# EAGLE design powermeter (EAGLE 7.2.0)
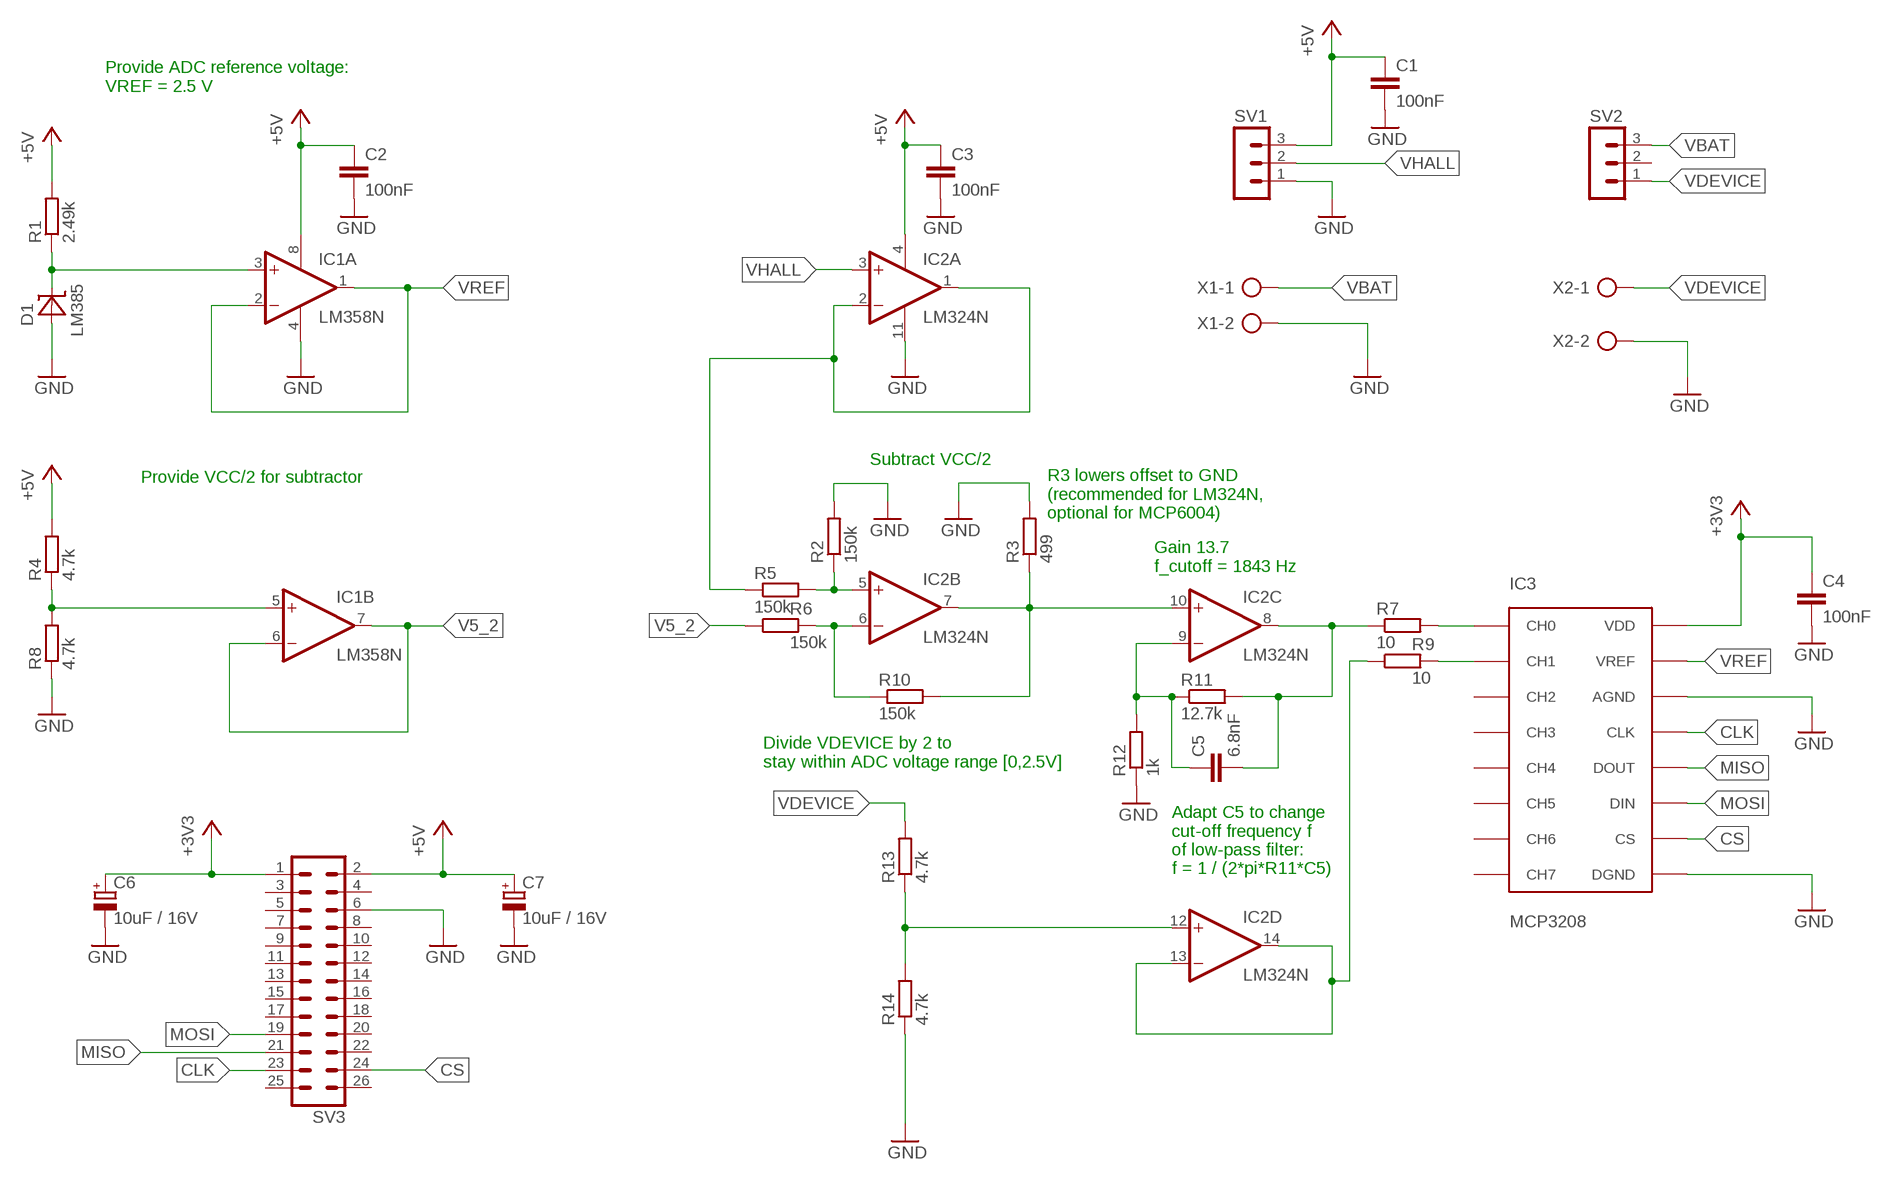
[diagram p0: schematic, sheet 1]

## Parts
C1  100nF  C-EU050-024X044  [C050-024X044]
C2  100nF  C-EU050-024X044  [C050-024X044]
C3  100nF  C-EU050-024X044  [C050-024X044]
C4  100nF  C-EU050-024X044  [C050-024X044]
C5  6.8nF  C-EU050-030X075  [C050-030X075]
C6  10uF / 16V  CPOL-EUE2.5-5  [E2,5-5]
C7  10uF / 16V  CPOL-EUE2.5-5  [E2,5-5]
D1  LM385  [TO-92]
IC1  LM358N  [DIL08]
IC2  LM324N  [DIL14]
IC3  MCP3208  [DIL16]
R1  2.49k  R-EU_0207/7  [0207/7]
R2  150k  R-EU_0207/7  [0207/7]
R3  499  R-EU_0207/7  [0207/7]
R4  4.7k  R-EU_0207/7  [0207/7]
R5  150k  R-EU_0207/7  [0207/7]
R6  150k  R-EU_0207/7  [0207/7]
R7  10  R-EU_0207/7  [0207/7]
R8  4.7k  R-EU_0207/7  [0207/7]
R9  10  R-EU_0207/7  [0207/7]
R10  150k  R-EU_0207/7  [0207/7]
R11  12.7k  R-EU_0207/7  [0207/7]
R12  1k  R-EU_0207/7  [0207/7]
R13  4.7k  R-EU_0207/7  [0207/7]
R14  4.7k  R-EU_0207/7  [0207/7]
SV1  MA03-1  [MA03-1]
SV2  MA03-1  [MA03-1]
SV3  ML26  [ML26]
X1  AK500/2  [AK500/2]
X2  AK500/2  [AK500/2]

## Nets
+3V3: C4.1 C6.+ IC3.VDD SV3.1
+5V: C1.1 C2.1 C3.1 C7.+ IC1.8(P:V+) IC2.4(P:V+) R1.2 R4.2 SV1.3 SV3.2
CLK: IC3.CLK SV3.23
CS: IC3.CS SV3.24
GND: C1.2 C2.2 C3.2 C4.2 C6.- C7.- D1.+ IC1.4(P:V-) IC2.11(P:V-) IC3.AGND IC3.DGND R2.2 R3.2 R8.1 R12.1 R14.1 SV1.1 SV3.6 X1.2 X2.2
MISO: IC3.DOUT SV3.21
MOSI: IC3.DIN SV3.19
N$1: IC1.5(B:+IN) R4.1 R8.2
N$2: C5.2 IC2.8(C:OUT) R7.1 R11.2
N$3: D1.- IC1.3(A:+IN) R1.1
N$4: IC2.1(A:OUT) IC2.2(A:-IN) R5.1
N$5: IC2.5(B:+IN) R2.1 R5.2
N$6: IC2.7(B:OUT) IC2.10(C:+IN) R3.1 R10.2
N$7: IC2.6(B:-IN) R6.2 R10.1
N$8: C5.1 IC2.9(C:-IN) R11.1 R12.2
N$10: IC3.CH0 R7.2
N$11: IC2.12(D:+IN) R13.1 R14.2
N$12: IC2.13(D:-IN) IC2.14(D:OUT) R9.1
N$13: IC3.CH1 R9.2
V5_2: IC1.6(B:-IN) IC1.7(B:OUT) R6.1
VBAT: SV2.3 X1.1
VDEVICE: R13.2 SV2.1 X2.1
VHALL: IC2.3(A:+IN) SV1.2
VREF: IC1.1(A:OUT) IC1.2(A:-IN) IC3.VREF
Unconnected: IC3.CH2 IC3.CH3 IC3.CH4 IC3.CH5 IC3.CH6 IC3.CH7 SV2.2 SV3.3 SV3.4 SV3.5 SV3.7 SV3.8 SV3.9 SV3.10 SV3.11 SV3.12 SV3.13 SV3.14 SV3.15 SV3.16 SV3.17 SV3.18 SV3.20 SV3.22 SV3.25 SV3.26

## Notes on the sheet
- Provide ADC reference voltage:
  VREF = 2.5 V
- Subtract VCC/2
- Provide VCC/2 for subtractor
- R3 lowers offset to GND
  (recommended for LM324N,
  optional for MCP6004)
- Gain 13.7
  f_cutoff = 1843 Hz
- Divide VDEVICE by 2 to
  stay within ADC voltage range [0,2.5V]
- Adapt C5 to change 
  cut-off frequency f
  of low-pass filter:
  f = 1 / (2*pi*R11*C5)

## Library data of the parts
C1-C5 = rcl:C-EU: CAPACITOR, European symbol
C6 C7 = rcl:CPOL-EU: POLARIZED CAPACITOR, European symbol
D1 = lm385:LM385: LM385 LM385 Micropower Voltage Reference
IC1 = linear:LM358: OP AMP also LM158; LM258; LM2904 Source: http://cache.national.com/ds/LM/LM158.pdf
IC2 = linear:LM324: OP AMP
IC3 = mcp3208:MCP3208
R1-R14 = rcl:R-EU_: RESISTOR, European symbol
SV1 SV2 = con-lstb:MA03-1: PIN HEADER; OC_FARNELL: unknown; OC_NEWARK: unknown
SV3 = con-harting-ml:ML26: HARTING; OC_FARNELL: unknown; OC_NEWARK: unknown
X1 X2 = con-ptr500:AK500/2: CONNECTOR; OC_FARNELL: unknown; OC_NEWARK: unknown

## Board
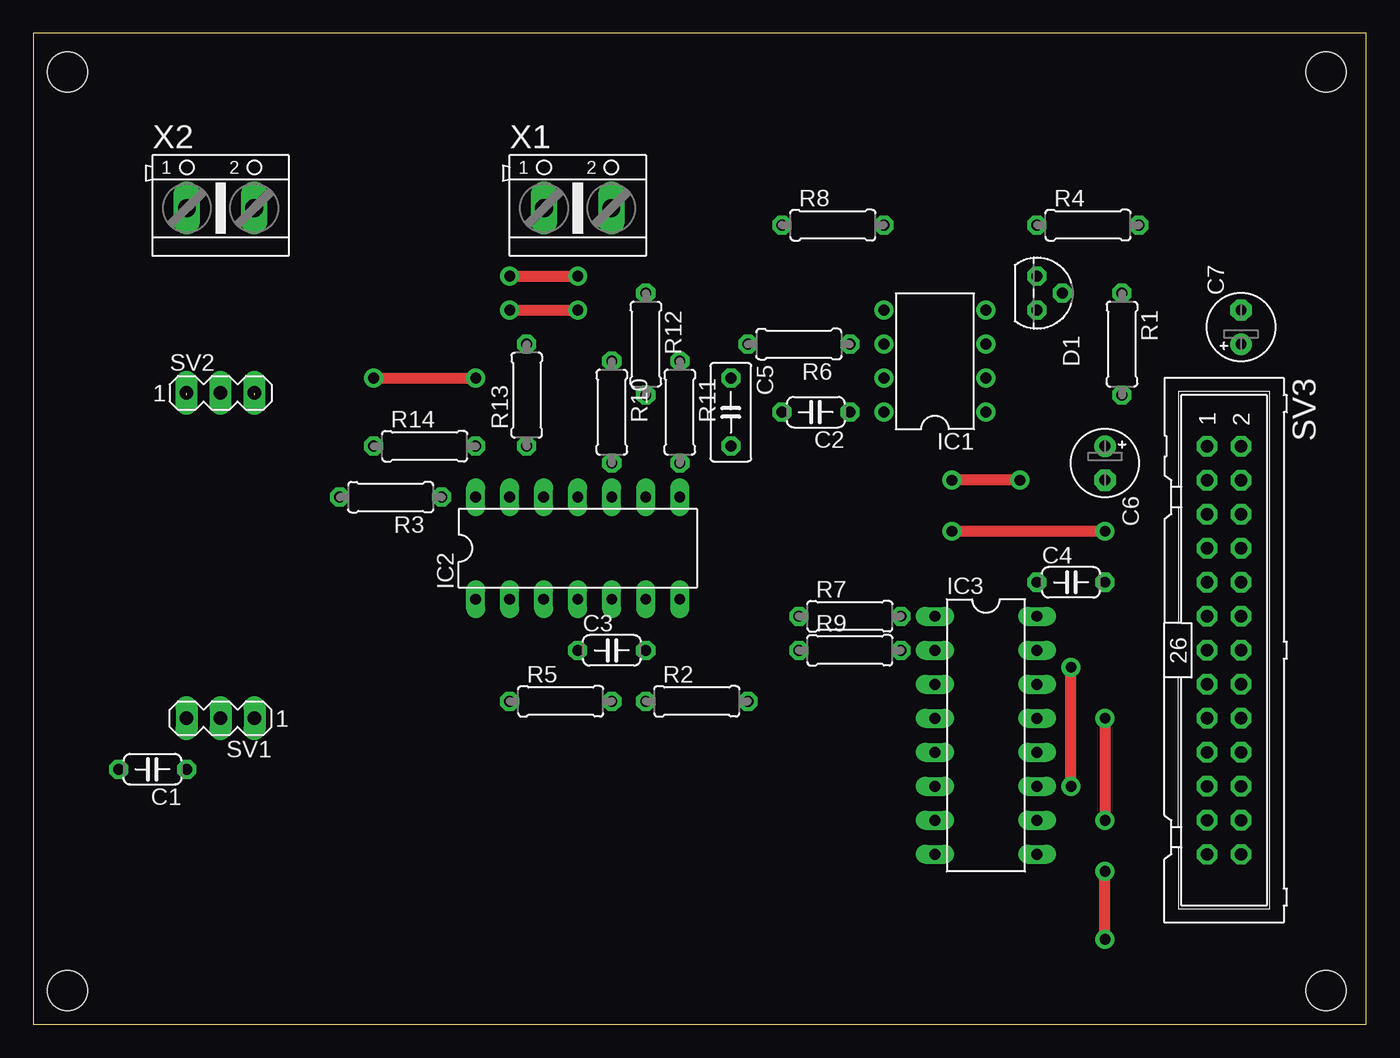
[diagram p1: board, top side]
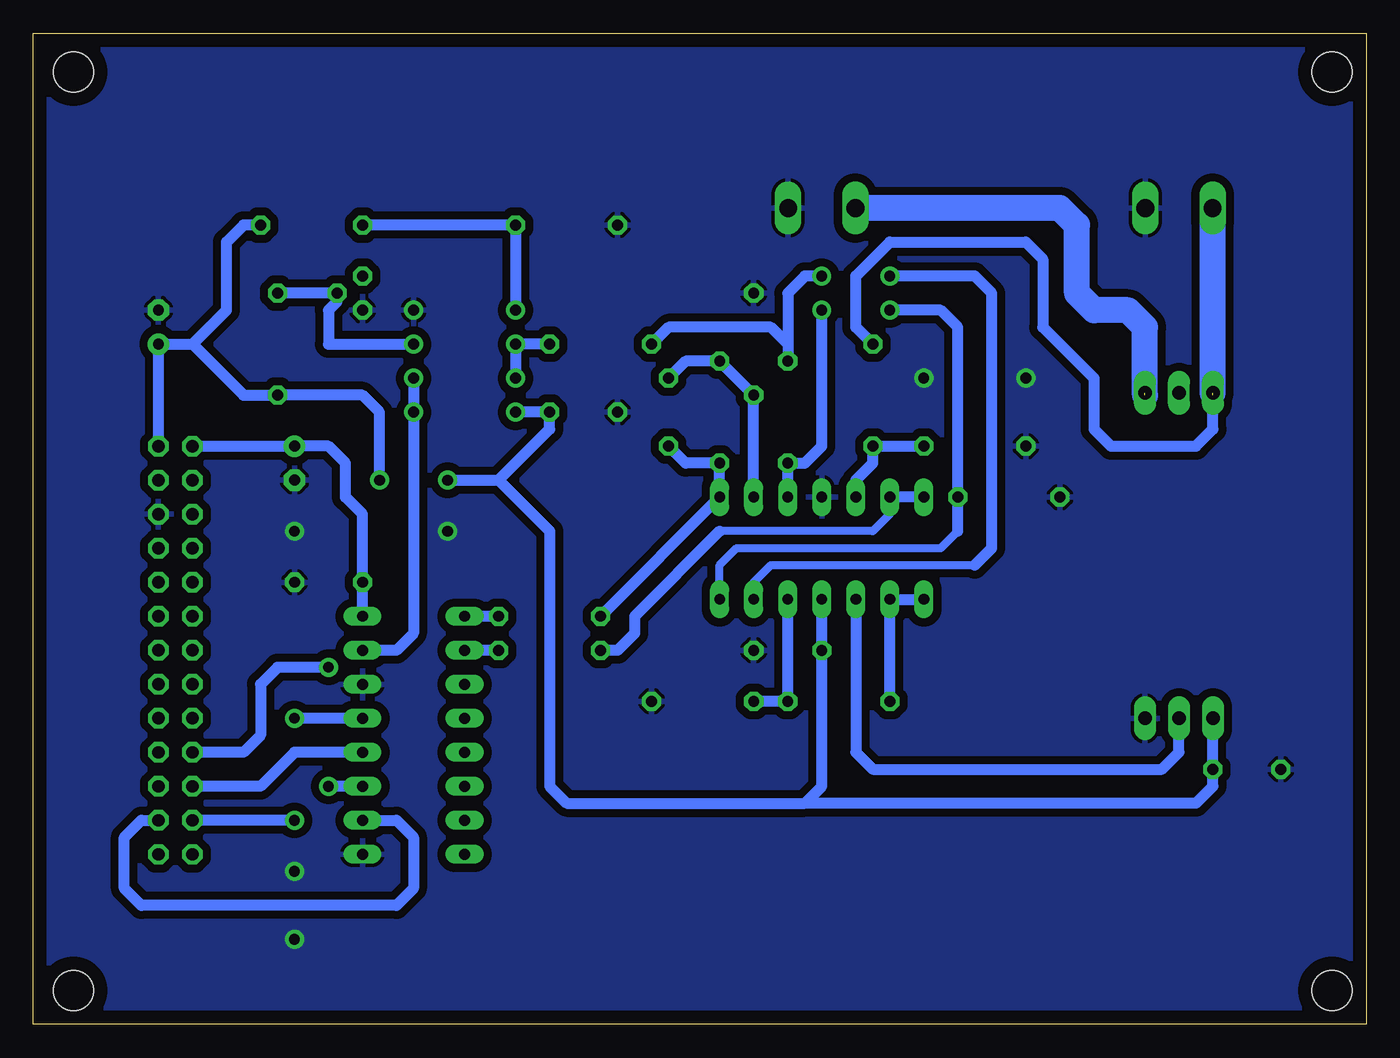
[diagram p2: board, bottom side, seen from below]

Size 99.5 x 74 mm. Coordinates in mm from the lower left corner, seen from the top.
Outline: 0,0 99.5,0 99.5,74 0,74 0,0
Copper layers (1*16): Top 0.035mm / dielectric 1.5mm / Bottom 0.035mm
Design rules "default *": minimum track width 10mil, minimum drill 24mil, track to track 24mil, track to pad 24mil, pad to pad 24mil, via to via 24mil, smd to smd 8mil, copper to edge 40mil, drill to drill 8mil, minimum pad ring 12mil, minimum via ring 12mil, stop-mask expansion 4mil, vias tented up to drill 0mil, thermal gap 10mil
Holes 3 mm at 2.54,71.12 96.52,71.12 2.54,2.54 96.52,2.54

### Footprints (pad centres in the part's own frame; a part is rotated, then mirrored left to right if it is on the bottom)
C050-024X044 = drill 0.813 octagon: 1 -2.54,0; 2 2.54,0
C050-030X075 = drill 0.813 octagon: 1 -2.54,0; 2 2.54,0
E2,5-5 = drill 0.813 pad 1.6: + -1.27,0 | drill 0.813 pad 1.6 octagon: - 1.27,0
TO-92 = drill 0.813 octagon: + 1.27,0; - 0,1.905; NC -1.27,0
DIL08 = drill 0.813 pad 1.27: 1 -3.81,-3.81; 2 -1.27,-3.81; 3 1.27,-3.81; 4 3.81,-3.81; 5 3.81,3.81; 6 1.27,3.81; 7 -1.27,3.81; 8 -3.81,3.81
DIL14 = drill 0.813 long: 1 -7.62,-3.81; 2 -5.08,-3.81; 3 -2.54,-3.81; 4 0,-3.81; 5 2.54,-3.81; 6 5.08,-3.81; 7 7.62,-3.81; 8 7.62,3.81; 9 5.08,3.81; 10 2.54,3.81; 11 0,3.81; 12 -2.54,3.81; 13 -5.08,3.81; 14 -7.62,3.81
DIL16 = drill 0.813 long: AGND -3.81,3.81; CH0 -8.89,-3.81; CH1 -6.35,-3.81; CH2 -3.81,-3.81; CH3 -1.27,-3.81; CH4 1.27,-3.81; CH5 3.81,-3.81; CH6 6.35,-3.81; CH7 8.89,-3.81; CLK -1.27,3.81; CS 6.35,3.81; DGND 8.89,3.81; DIN 3.81,3.81; DOUT 1.27,3.81; VDD -8.89,3.81; VREF -6.35,3.81
0207/7 = drill 0.813 octagon: 1 -3.81,0; 2 3.81,0
MA03-1 = drill 1.016 long: 1 -2.54,0; 2 0,0; 3 2.54,0
ML26 = drill 0.914 octagon: 1 -15.24,-1.27; 2 -15.24,1.27; 3 -12.7,-1.27; 4 -12.7,1.27; 5 -10.16,-1.27; 6 -10.16,1.27; 7 -7.62,-1.27; 8 -7.62,1.27; 9 -5.08,-1.27; 10 -5.08,1.27; 11 -2.54,-1.27; 12 -2.54,1.27; 13 0,-1.27; 14 0,1.27; 15 2.54,-1.27; 16 2.54,1.27; 17 5.08,-1.27; 18 5.08,1.27; 19 7.62,-1.27; 20 7.62,1.27; 21 10.16,-1.27; 22 10.16,1.27; 23 12.7,-1.27; 24 12.7,1.27; 25 15.24,-1.27; 26 15.24,1.27
AK500/2 = drill 1.321 long: 1 -2.515,0; 2 2.515,0

### Placement (x,y rotation side)
C1  8.89,19.05 180 top
C2  58.42,45.72 180 top
C3  43.18,27.94 0 top
C4  77.47,33.02 0 top
C5  52.07,45.72 270 top
C6  80.01,41.91 270 top
C7  90.17,52.07 90 top
D1  74.93,54.61 270 top
IC1  67.31,49.53 90 top
IC2  40.64,35.56 0 top
IC3  71.12,21.59 270 top
R1  81.28,50.8 270 top
R2  49.53,24.13 0 top
R3  26.67,39.37 180 top
R4  78.74,59.69 0 top
R5  39.37,24.13 0 top
R6  57.15,50.8 180 top
R7  60.96,30.48 0 top
R8  59.69,59.69 0 top
R9  60.96,27.94 0 top
R10  43.18,45.72 270 top
R11  48.26,45.72 270 top
R12  45.72,50.8 270 top
R13  36.83,46.99 90 top
R14  29.21,43.18 0 top
SV1  13.97,22.86 180 top
SV2  13.97,47.16 0 top
SV3  88.9,27.94 270 top
X1  40.64,60.96 0 top
X2  13.97,60.96 0 top

### Tracks (layer width: path | path; a pad name or v marks a point on that pad's centre or on a via)
+3V3
  Bottom 0.813: IC3.VDD C4.1 74.93,38.1 76.2,39.37 76.2,41.91 77.47,43.18 C6.+ SV3.1
+5V  (via drill 0.8)
  Top 0.813: v73.66,40.64 v68.58,40.64
  Bottom 0.813: IC2.4 C3.1 40.64,17.78 41.91,16.51 | IC1.8 C2.1 60.96,44.45 64.77,40.64 | R4.2 83.82,59.69 85.09,58.42 85.09,53.34 87.63,50.8 | v68.58,40.64 64.77,40.64 | 64.77,40.64 60.96,36.83 60.96,17.78 59.69,16.51 41.91,16.51 | v73.66,40.64 73.66,45.72 74.93,46.99 R1.2 83.82,46.99 87.63,50.8 | 41.91,16.51 12.7,16.51 11.43,17.78 C1.1 SV1.3 | SV3.2 C7.+ 87.63,50.8
CLK  (via drill 0.8)
  Top 0.813: v80.01,22.86 v80.01,15.24
  Bottom 0.813: IC3.CLK v80.01,22.86 | v80.01,15.24 SV3.23
CS
  Bottom 0.813: IC3.CS 72.39,15.24 71.12,13.97 71.12,10.16 72.39,8.89 91.44,8.89 92.71,10.16 92.71,13.97 91.44,15.24 SV3.24
GND  (via drill 0.8)
  Top 0.813: v25.4,48.26 v33.02,48.26 | v80.01,6.35 v80.01,11.43 | v68.58,36.83 v80.01,36.83
  pour Bottom: -2.54,76.2 -2.54,-2.54 101.6,-2.54 101.6,77.47 -2.54,77.47
MISO
  Bottom 0.813: IC3.DOUT 80.01,20.32 82.55,17.78 SV3.21
MOSI  (via drill 0.8)
  Top 0.813: v77.47,17.78 v77.47,26.67
  Bottom 0.813: IC3.DIN v77.47,17.78 | v77.47,26.67 81.28,26.67 82.55,25.4 82.55,21.59 83.82,20.32 SV3.19
N$1
  Bottom 0.813: IC1.5 R8.2 R4.1
N$2
  Bottom 0.813: R7.1 IC2.8 R11.2 50.8,41.91 C5.2
N$3
  Bottom 0.61: D1.- 76.83,53.98
  Bottom 0.813: D1.- R1.1 | 76.83,53.98 77.47,53.34 77.47,50.8 IC1.3
N$4
  Bottom 0.813: R5.1 IC2.2 IC2.1
N$5
  Bottom 0.813: R2.1 R5.2 IC2.5
N$6  (via drill 0.8)
  Top 0.813: v35.56,53.34 v40.64,53.34
  Bottom 0.61: IC2.7 48.26,34.29 46.99,35.56 31.75,35.56 30.48,36.83
  Bottom 0.813: IC2.10 R10.2 41.91,41.91 40.64,43.18 v40.64,53.34 | v35.56,53.34 31.75,53.34 30.48,52.07 R3.1 30.48,36.83
N$7  (via drill 0.8)
  Top 0.813: v35.56,55.88 v40.64,55.88
  Bottom 0.61: IC2.6 45.72,33.02 44.45,34.29 29.21,34.29 | 43.18,50.8 R10.1
  Bottom 0.813: 29.21,34.29 27.94,35.56 27.94,54.61 29.21,55.88 v35.56,55.88 | 43.18,50.8 44.45,52.07 52.07,52.07 R6.2 | v40.64,55.88 41.91,55.88 43.18,54.61 R10.1
N$8
  Bottom 0.61: R12.2 45.72,45.72
  Bottom 0.813: IC2.9 R12.2 R11.1 50.8,49.53 C5.1
N$10
  Bottom 0.813: R7.2 IC3.CH0
N$11
  Bottom 0.813: R14.2 R13.1 36.83,41.91 38.1,40.64 IC2.12
N$12
  Bottom 0.61: IC2.13 35.56,38.1 36.83,36.83 48.26,36.83
  Bottom 0.813: IC2.14 IC2.13 | 48.26,36.83 54.61,30.48 54.61,29.21 55.88,27.94 R9.1
N$13
  Bottom 0.813: R9.2 IC3.CH1
V5_2
  Bottom 0.813: R6.1 IC1.6 IC1.7
VBAT  (1 unrouted)
  Bottom 1.93: 16.51,46.99 16.51,52.07 17.78,53.34 20.32,53.34 21.59,54.61 21.59,59.69 22.86,60.96 X1.1
VDEVICE  (1 unrouted)
  Bottom 0.813: R13.2 38.1,52.07 38.1,55.88 35.56,58.42 25.4,58.42 24.13,57.15 24.13,52.07 20.32,48.26 20.32,44.45 19.05,43.18 12.7,43.18 11.43,44.45 11.43,46.99
  Bottom 1.422: SV2.1 11.46,47.16
  Bottom 1.93: 11.46,47.16 X2.1
VHALL
  Bottom 0.813: IC2.3 38.1,20.32 36.83,19.05 15.24,19.05 13.97,20.32 SV1.2
VREF
  Bottom 0.813: IC1.2 IC1.1 71.12,29.21 72.39,27.94 IC3.VREF